# EAGLE design COMANDO (EAGLE 6.5.0)
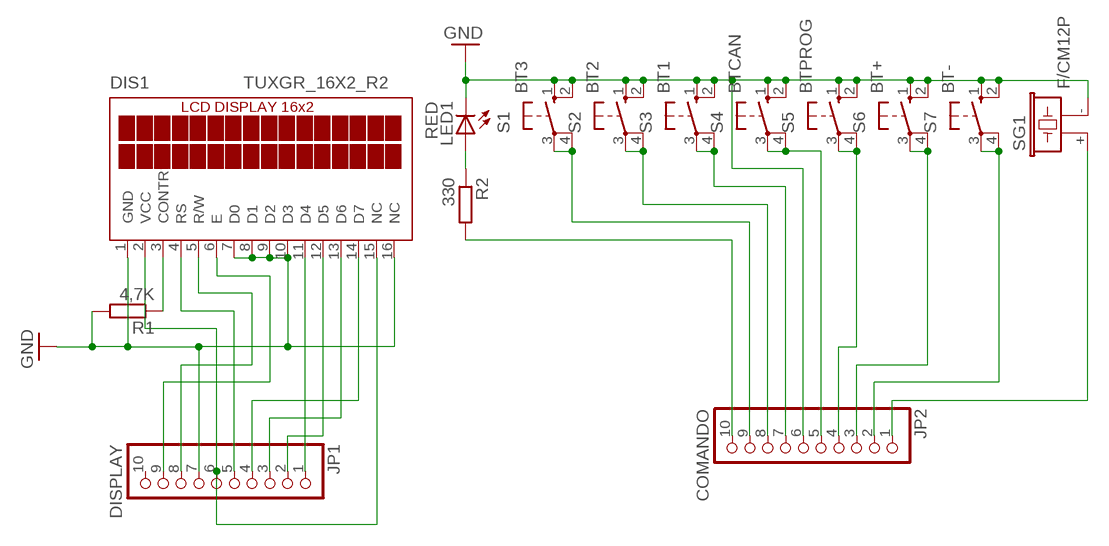
[diagram p0: schematic, sheet 1]

## Parts
DIS1  TUXGR_16X2_R2  [TUXGR_16X2_R2]
JP1  DISPLAY  PINHD-1X10  [1X10]
JP2  COMANDO  PINHD-1X10  [1X10]
LED1  RED  LED3MM  [LED3MM]
R1  4,7K  R-EU_0207/10  [0207/10]
R2  330  R-EU_0207/10  [0207/10]
S1  BT3  10-XX  [B3F-10XX]
S2  BT2  10-XX  [B3F-10XX]
S3  BT1  10-XX  [B3F-10XX]
S4  BTCAN  10-XX  [B3F-10XX]
S5  BTPROG  10-XX  [B3F-10XX]
S6  BT+  10-XX  [B3F-10XX]
S7  BT-  10-XX  [B3F-10XX]
SG1  F/CM12P  [F/CM12P]

## Nets
GND: DIS1.1(GND) DIS1.7(D0) DIS1.8(D1) DIS1.9(D2) DIS1.10(D3) DIS1.16(NC) JP1.7 JP2.6 LED1.K(C) R1.2 S1.1(S) S1.2(S1) S2.1(S) S2.2(S1) S3.1(S) S3.2(S1) S4.1(S) S4.2(S1) S5.1(S) S5.2(S1) S6.1(S) S6.2(S1) S7.1(S) S7.2(S1) SG1.-
N$1: DIS1.11(D4) JP1.1
N$2: DIS1.12(D5) JP1.2
N$3: DIS1.13(D6) JP1.3
N$4: DIS1.14(D7) JP1.4
N$6: DIS1.2(VCC) DIS1.15(NC) JP1.6
N$7: DIS1.3(CONTR) R1.1
N$8: DIS1.4(RS) JP1.5
N$9: DIS1.5(R/W) JP1.8
N$10: DIS1.6(E) JP1.9
N$12: JP2.1 SG1.+
N$13: JP2.2 S7.3(P) S7.4(P1)
N$14: JP2.3 S6.3(P) S6.4(P1)
N$15: JP2.4 S5.3(P) S5.4(P1)
N$16: JP2.5 S4.3(P) S4.4(P1)
N$17: JP2.7 S3.3(P) S3.4(P1)
N$18: JP2.8 S2.3(P) S2.4(P1)
N$19: JP2.9 S1.3(P) S1.4(P1)
N$21: LED1.A R2.1
N$28: JP2.10 R2.2
Unconnected: JP1.10

## Library data of the parts
DIS1 = display-lcd:TUXGR_16X2_R2: Tuxgraphics LCD display 16x2 characters reflective, without background light Source: tuxgr_12x2_r2.pdf; OC_FARNELL: unknown; OC_NEWARK: unknown
JP1 JP2 = pinhead:PINHD-1X10: PIN HEADER
LED1 = led:LED: LED OSRAM: - CHIPLED LG R971, LG N971, LY N971, LG Q971, LY Q971, LO R971, LY R971 LH N974, LH R974 LS Q976, LO Q976, LY Q976 LO Q996 - Hyper CHIPLED LW Q18S LB Q993, LB Q99A, LB R99A - SideLED LS A670, LO A670, LY A670, LG A670, LP A670 LB A673, LV A673, LT A673, LW A673 LH A674 LY A675 LS A676, LA A676, LO A676, LY A676, LW A676 LS A679, LY A679, LG A679 - Hyper Micro SIDELED® LS Y876, LA Y876, LO Y876, LY Y876 LT Y87S - SmartLED LW L88C, LW L88S LB L89C, LB L89S, LG L890 LS L89K, LO L89K, LY L89K LS L896, LA L896, LO L896, LY L896 - TOPLED LS T670, LO T670, LY T670, LG T670, LP T670 LSG T670, LSP T670, LSY T670, LOP T670, LYG T670 LG T671, LOG T671, LSG T671 LB T673, LV T673, LT T673, LW T673 LH T674 LS T676, LA T676, LO T676, LY T676, LB T676, LH T676, LSB T676, LW T676 LB T67C, LV T67C, LT T67C, LS T67K, LO T67K, LY T67K, LW E67C LS E67B, LA E67B, LO E67B, LY E67B, LB E67C, LV E67C, LT E67C LW T67C LS T679, LY T679, LG T679 LS T770, LO T770, LY T770, LG T770, LP T770 LB T773, LV T773, LT T773, LW T773 LH T774 LS E675, LA E675, LY E675, LS T675 LS T776, LA T776, LO T776, LY T776, LB T776 LHGB T686 LT T68C, LB T68C - Hyper Mini TOPLED® LB M676 - Mini TOPLED Santana® LG M470 LS M47K, LO M47K, LY M47K Source: http://www.osram.convergy.de LUXEON: - LUMILED® LXK2-PW12-R00, LXK2-PW12-S00, LXK2-PW14-U00, LXK2-PW14-V00 LXK2-PM12-R00, LXK2-PM12-S00, LXK2-PM14-U00 LXK2-PE12-Q00, LXK2-PE12-R00, LXK2-PE12-S00, LXK2-PE14-T00, LXK2-PE14-U00 LXK2-PB12-K00, LXK2-PB12-L00, LXK2-PB12-M00, LXK2-PB14-N00, LXK2-PB14-P00, LXK2-PB14-Q00 LXK2-PR12-L00, LXK2-PR12-M00, LXK2-PR14-Q00, LXK2-PR14-R00 LXK2-PD12-Q00, LXK2-PD12-R00, LXK2-PD12-S00 LXK2-PH12-R00, LXK2-PH12-S00 LXK2-PL12-P00, LXK2-PL12-Q00, LXK2-PL12-R00 Source: www.luxeon.com KINGBRIGHT: KA-3528ASYC Source: www.kingbright.com
R1 R2 = rcl:R-EU_: RESISTOR, European symbol
S1-S7 = switch-omron:10-XX: OMRON SWITCH; MPN: B3F-1000; OC_FARNELL: 176432; OC_NEWARK: 36M3542
SG1 = buzzer:F/CM12P: BUZZER Source: Buerklin; OC_FARNELL: unknown; OC_NEWARK: unknown

## Board
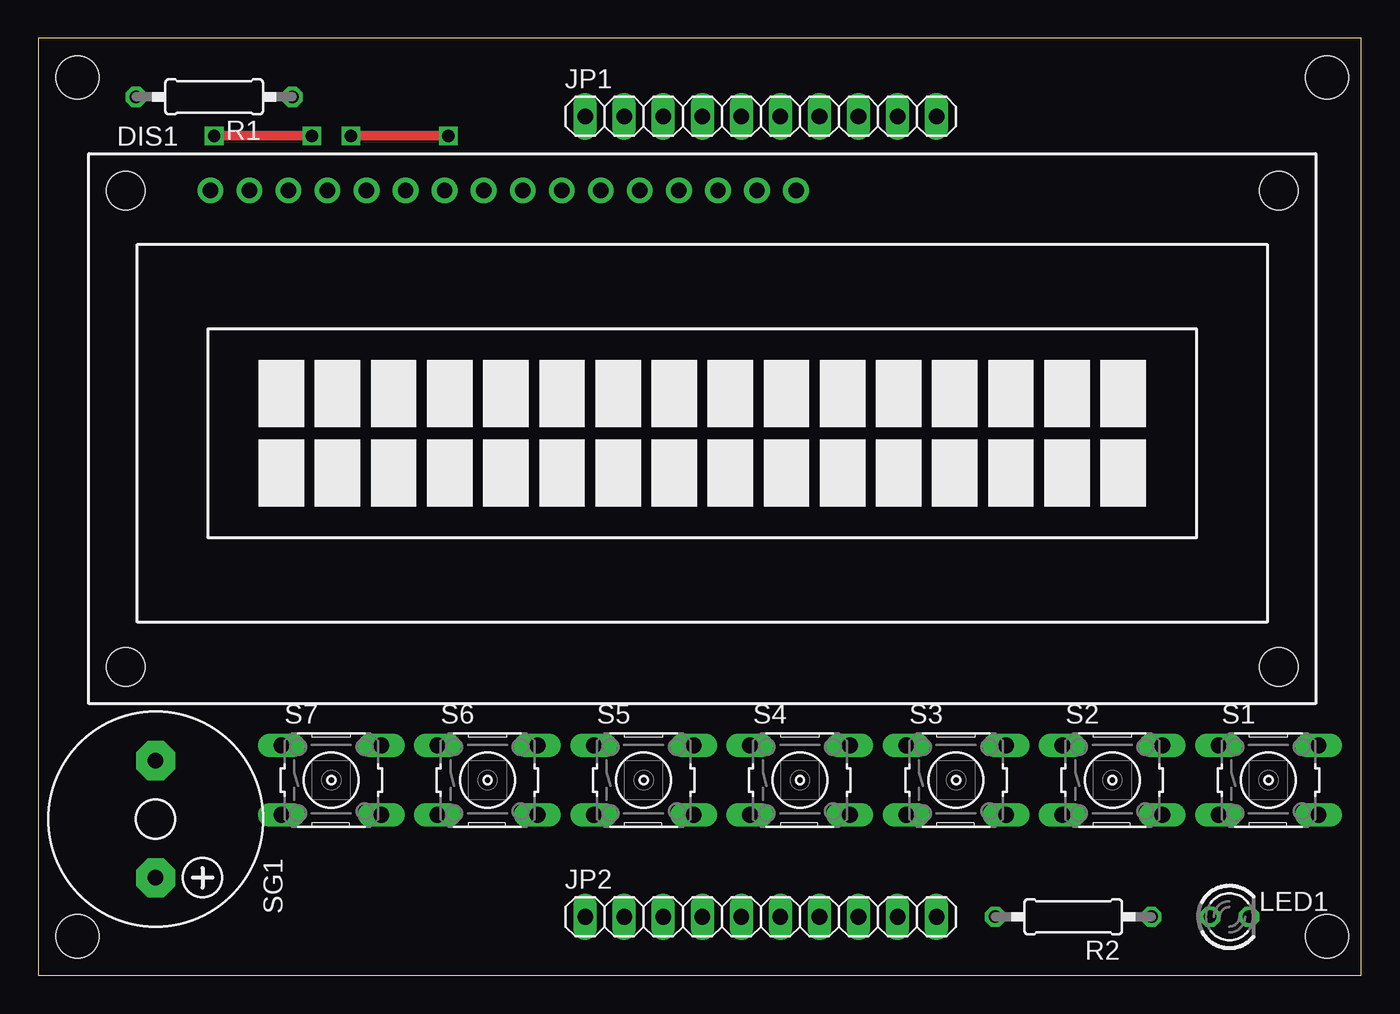
[diagram p1: board, top side]
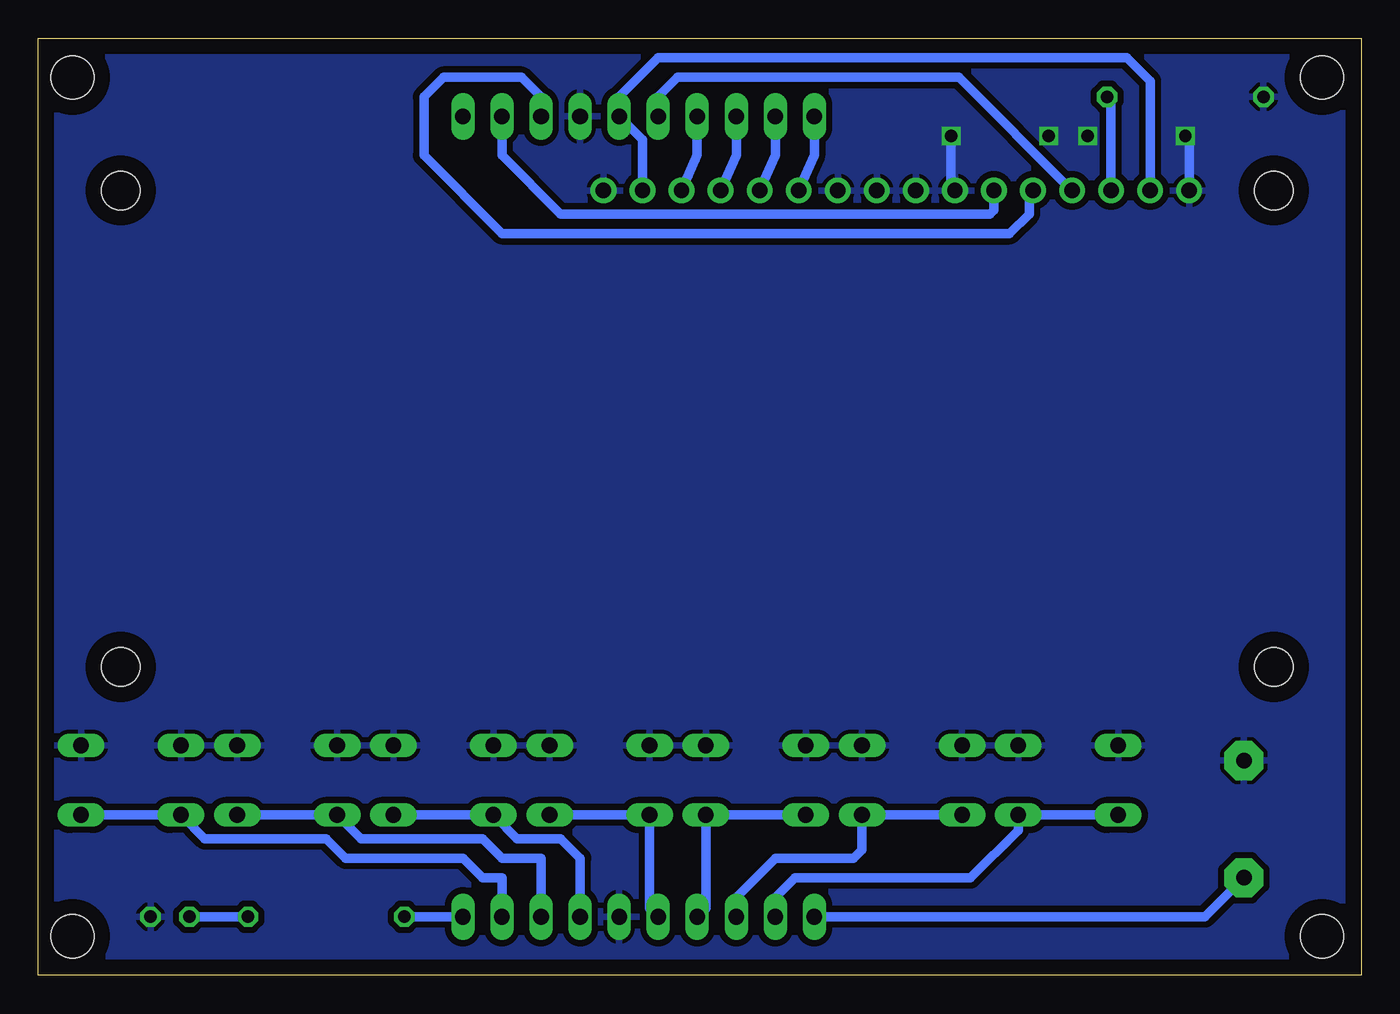
[diagram p2: board, bottom side, seen from below]

Size 86.03 x 60.95 mm. Coordinates in mm from the lower left corner, seen from the top.
Outline: 0,0 86.03,0 86.03,60.95 0,60.95 0,0
Copper layers (1*16): Top 0.035mm / dielectric 1.5mm / Bottom 0.035mm
Design rules "default": minimum track width 10mil, minimum drill 24mil, track to track 8mil, track to pad 8mil, pad to pad 8mil, via to via 8mil, smd to smd 8mil, copper to edge 40mil, drill to drill 8mil, minimum pad ring 10mil, minimum via ring 8mil, stop-mask expansion 4mil, vias tented up to drill 0mil, thermal gap 10mil
Holes 2.8 mm at 2.54,58.42 2.54,2.54 83.82,2.54 83.82,58.42

### Footprints (pad centres in the part's own frame; a part is rotated, then mirrored left to right if it is on the bottom)
TUXGR_16X2_R2 = drill 1 pad 1.676: 1 -32,15.5; 2 -29.46,15.5; 3 -26.92,15.5; 4 -24.38,15.5; 5 -21.84,15.5; 6 -19.3,15.5; 7 -16.76,15.5; 8 -14.22,15.5; 9 -11.68,15.5; 10 -9.14,15.5; 11 -6.6,15.5; 12 -4.06,15.5; 13 -1.52,15.5; 14 1.02,15.5; 15 3.56,15.5; 16 6.1,15.5 | hole 2.5: -37.5,-15.5; 37.5,-15.5; -37.5,15.5; 37.5,15.5
1X10 = drill 1.016 long: 1 -11.43,0; 2 -8.89,0; 3 -6.35,0; 4 -3.81,0; 5 -1.27,0; 6 1.27,0; 7 3.81,0; 8 6.35,0; 9 8.89,0; 10 11.43,0
LED3MM = drill 0.813 octagon: A -1.27,0; K 1.27,0
0207/10 = drill 0.813 octagon: 1 -5.08,0; 2 5.08,0
B3F-10XX = drill 1.016 long: 1 -3.251,2.261; 2 3.251,2.261; 3 -3.251,-2.261; 4 3.251,-2.261
F/CM12P = drill 1.016 pad 2.54 octagon: + 3.81,0; - -3.81,0

### Placement (x,y rotation side)
DIS1  43.18,35.56 0 top
JP1  46.99,55.88 0 top
JP2  46.99,3.81 0 top
LED1  77.47,3.81 0 top
R1  11.43,57.15 180 top
R2  67.31,3.81 180 top
S1  80.01,12.7 0 top
S2  69.85,12.7 0 top
S3  59.69,12.7 0 top
S4  49.53,12.7 0 top
S5  39.37,12.7 0 top
S6  29.21,12.7 0 top
S7  19.05,12.7 0 top
SG1  7.62,10.16 270 top

### Tracks (layer width: path | path; a pad name or v marks a point on that pad's centre or on a via)
GND  (via drill 0.6, 0.8)
  Top 0.61: v20.32,54.61 v26.67,54.61 | v11.43,54.61 v17.78,54.61
  Bottom 0.61: v26.67,54.61 26.67,50.8 | DIS1.1 11.18,54.36 v11.43,54.61
  pour Bottom (isolate 0.406): 0,60.96 0,0 86.36,0 86.36,60.96
N$1
  Bottom 0.61: JP1.1 35.56,53.35 DIS1.11
N$2
  Bottom 0.61: DIS1.12 38.1,53.35 JP1.2
N$3
  Bottom 0.61: DIS1.13 40.64,53.35 JP1.3
N$4
  Bottom 0.61: DIS1.14 43.18,53.35 JP1.4
N$6
  Bottom 0.61: DIS1.15 46.74,54.36 JP1.6 48.26,57.15 45.72,59.69 15.24,59.69 13.72,58.17 DIS1.2
N$7
  Bottom 0.61: DIS1.3 16.26,56.9 R1.1
N$8
  Bottom 0.61: JP1.5 45.72,57.15 44.45,58.42 26.16,58.42 DIS1.4
N$9
  Bottom 0.61: JP1.8 53.34,57.15 54.61,58.42 59.69,58.42 60.96,57.15 60.96,53.34 55.88,48.26 22.86,48.26 21.59,49.53 21.59,50.81 DIS1.5
N$10
  Bottom 0.61: DIS1.6 23.88,49.78 24.13,49.53 52.07,49.53 55.88,53.34 JP1.9
N$12
  Bottom 0.61: SG1.+ 10.16,3.81 JP2.1
N$13
  Bottom 0.61: S7.3 S7.4 22.3,9.45 25.4,6.35 36.83,6.35 38.1,5.08 JP2.2
N$14
  Bottom 0.61: S6.3 S6.4 32.46,8.18 33.02,7.62 38.1,7.62 40.64,5.08 JP2.3
N$15
  Bottom 0.61: S5.3 S5.4 42.62,4.37 JP2.4
N$16
  Bottom 0.61: JP2.5 46.28,4.37 S4.3 S4.4
N$17
  Bottom 0.61: JP2.7 50.8,7.62 52.07,8.89 54.89,8.89 S3.3 S3.4
N$18
  Bottom 0.61: S2.4 S2.3 65.05,8.89 57.15,8.89 55.88,7.62 53.34,7.62 JP2.8
N$19
  Bottom 0.61: JP2.9 55.88,6.35 57.15,6.35 58.42,7.62 66.04,7.62 67.31,8.89 75.21,8.89 S1.3 S1.4
N$21
  Bottom 0.61: R2.1 LED1.A
N$28
  Bottom 0.61: JP2.10 R2.2